# Altium schematic sheet PLC_DIY.SchDoc: PLC_DIY
size A3; DocumentNumber: 1; SheetNumber: 1; SheetTotal: 10
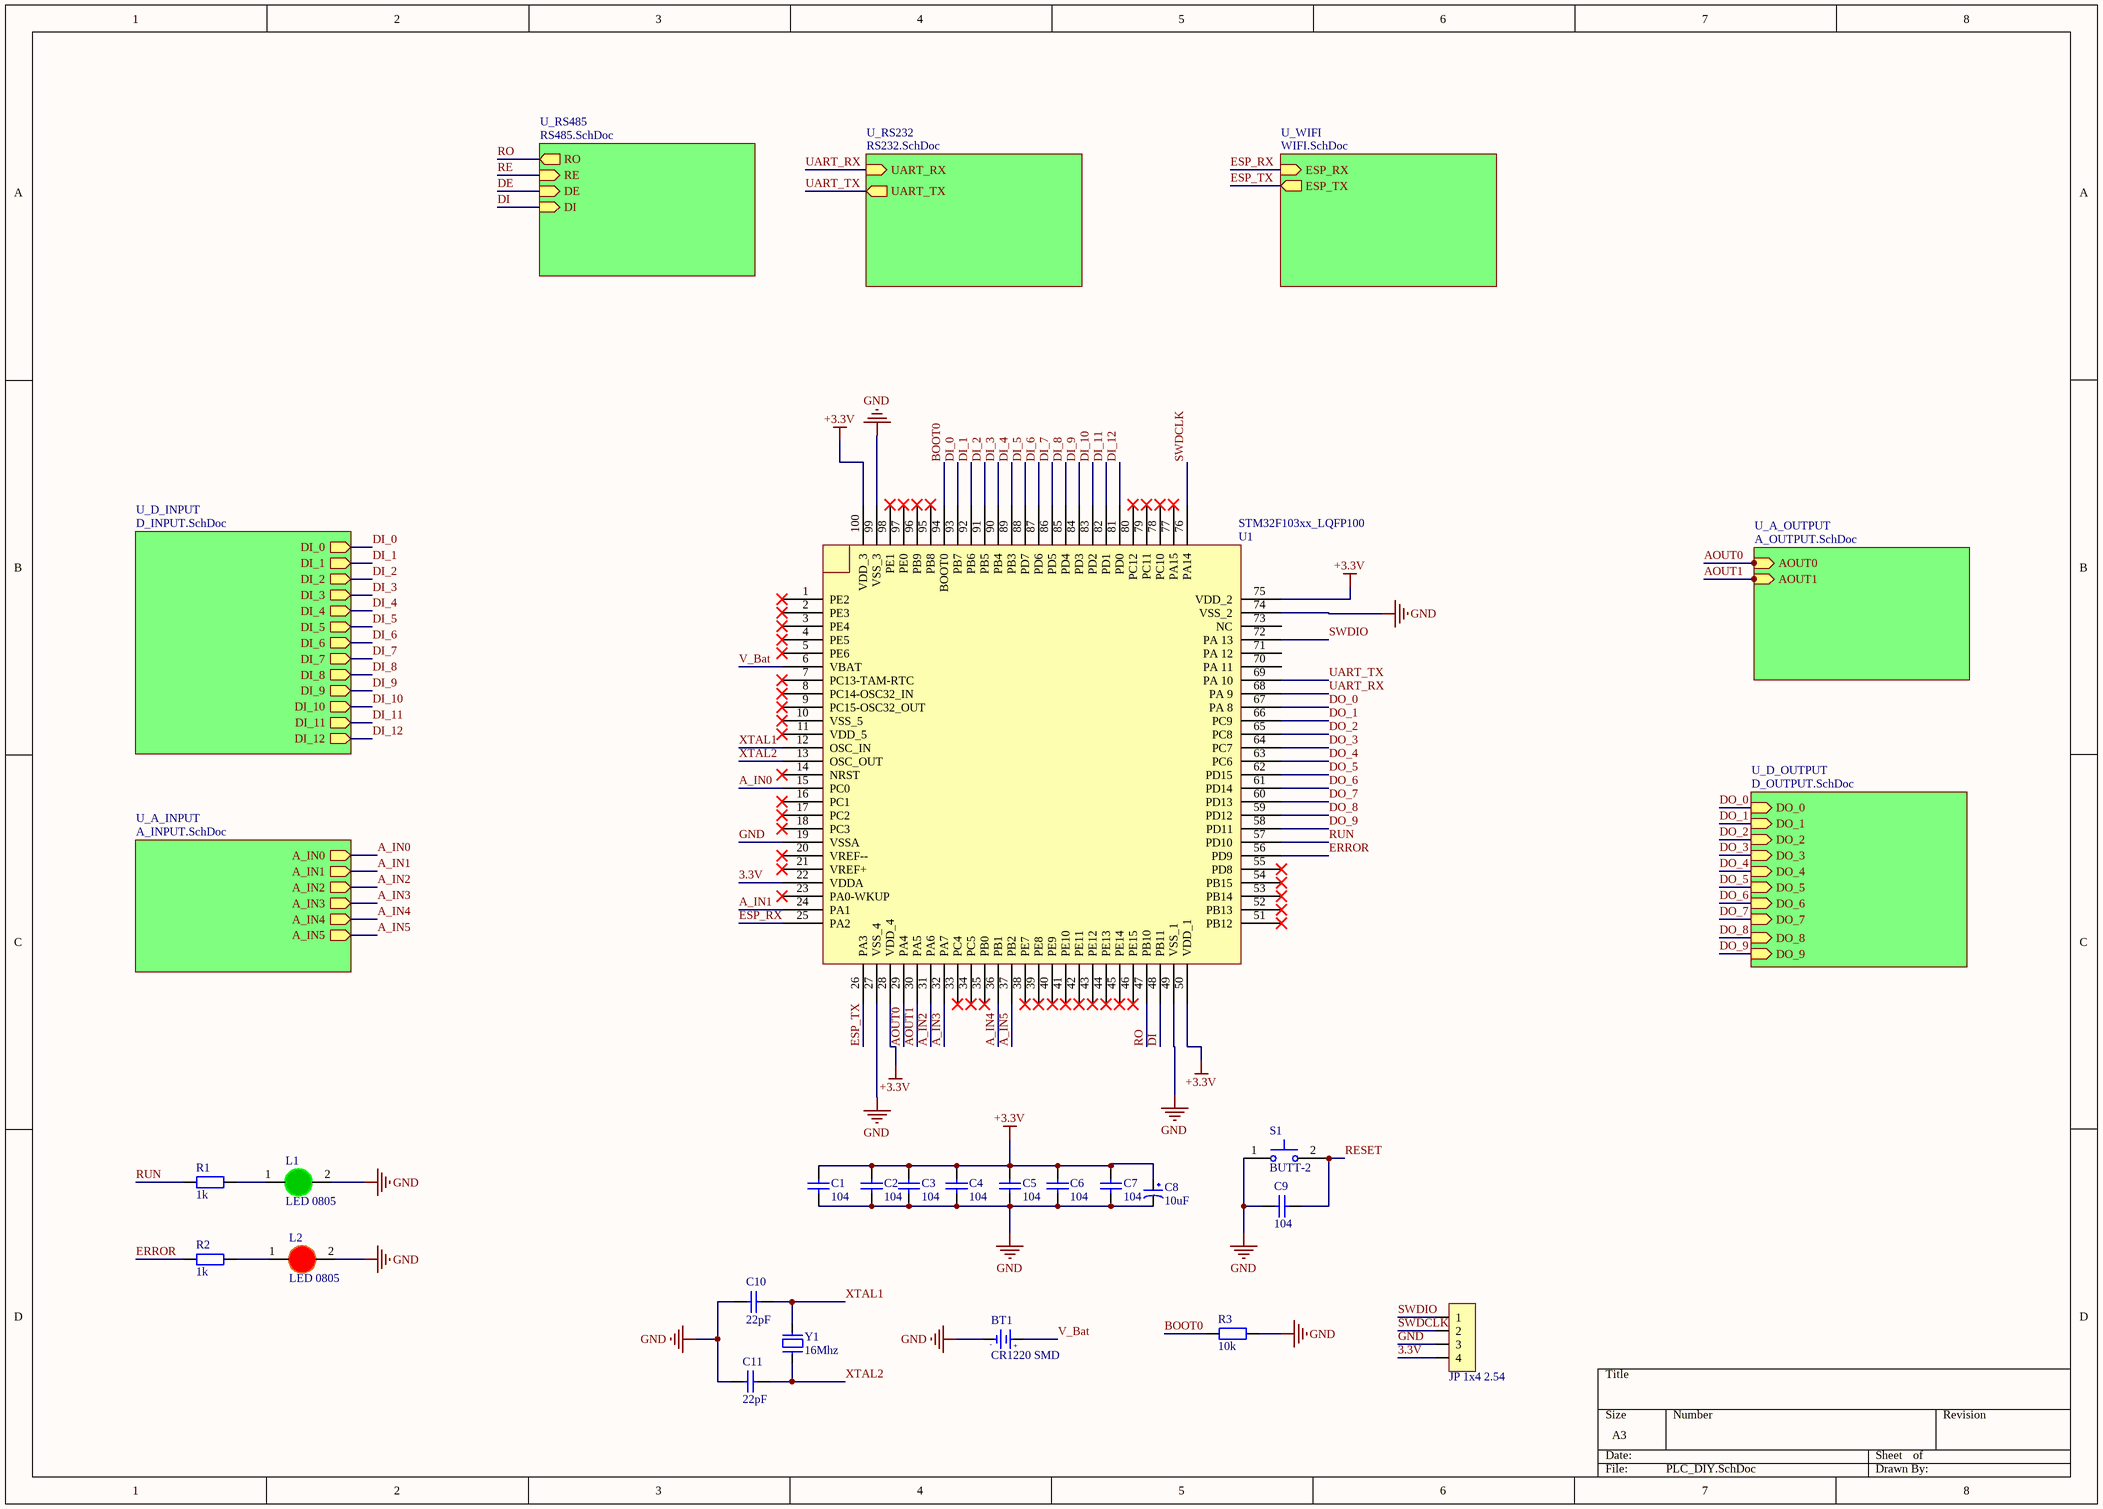
[diagram p0: PLC_DIY.SchDoc]

## Parts
BT1  CR1220 SMD  [DE PIN CR1220]
C1  104  [tu 0805]
C2  104  [tu 0805]
C3  104  [tu 0805]
C4  104  [tu 0805]
C5  104  [tu 0805]
C6  104  [tu 0805]
C7  104  [tu 0805]
C8  10uF  [tu tantalum smd3528]
C9  104  [tu 0805]
C10  22pF  [tu 0805]
C11  22pF  [tu 0805]
JP1  JP 1x4 2.54  [JP 1x4 DC]
L1  LED 0805  [LED-0805-Green]
L2  LED 0805  [LED-0805-Red]
R1  1k  [tro smd 0805]
R2  1k  [tro smd 0805]
R3  10k  [tro smd 0805]
S1  BUTT-2  [SW_BUTT-2]
U1  STM32F103xx_LQFP100  [STM32_LQFP100]
Y1  16Mhz  [Thach Anh 2 chan SMD]

## Sub-sheets
U_A_INPUT = A_INPUT.SchDoc: A_IN0 (out), A_IN1 (out), A_IN2 (out), A_IN3 (out), A_IN4 (out), A_IN5 (out)
U_A_OUTPUT = A_OUTPUT.SchDoc: AOUT0 (in), AOUT1 (in)
U_D_INPUT = D_INPUT.SchDoc: DI_0 (out), DI_1 (out), DI_2 (out), DI_3 (out), DI_4 (out), DI_5 (out), DI_6 (out), DI_7 (out), DI_8 (out), DI_9 (out), DI_10 (out), DI_11 (out), DI_12 (out)
U_D_OUTPUT = D_OUTPUT.SchDoc: DO_0 (in), DO_1 (in), DO_2 (in), DO_3 (in), DO_4 (in), DO_9 (in), DO_5 (in), DO_6 (in), DO_7 (in), DO_8 (in)
U_RS232 = RS232.SchDoc: UART_TX (out), UART_RX (in)
U_RS485 = RS485.SchDoc: RO (out), RE (in), DE (in), DI (in)
U_WIFI = WIFI.SchDoc: ESP_TX (out), ESP_RX (in)

## Nets
+3.3V: C1.1 C2.1 C3.1 C4.1 C5.1 C6.1 C7.1 C8.1 U1.28(VDD_4) U1.50(VDD_1) U1.75(VDD_2) U1.100(VDD_3)
GND: BT1.2(GND) C1.2 C2.2 C3.2 C4.2 C5.2 C6.2 C7.2 C8.2 C9.1 C10.2 C11.2 JP1.3 L1.2(K) L2.2(K) R3.2 S1.1 U1.19(VSSA) U1.27(VSS_4) U1.49(VSS_1) U1.74(VSS_2) U1.99(VSS_3)
3.3V: JP1.4 U1.22(VDDA)
A_IN0: U1.15(PC0) ; sheet U_A_INPUT/A_IN0
A_IN1: U1.24(PA1) ; sheet U_A_INPUT/A_IN1
A_IN2: U1.31(PA6) ; sheet U_A_INPUT/A_IN2
A_IN3: U1.32(PA7) ; sheet U_A_INPUT/A_IN3
A_IN4: U1.36(PB1) ; sheet U_A_INPUT/A_IN4
A_IN5: U1.37(PB2) ; sheet U_A_INPUT/A_IN5
AOUT0: U1.29(PA4) ; sheet U_A_OUTPUT/AOUT0
AOUT1: U1.30(PA5) ; sheet U_A_OUTPUT/AOUT1
BOOT0: R3.1 U1.94(BOOT0)
DE: sheet U_RS485/DE
DI: U1.48(PB11) ; sheet U_RS485/DI
DI_0: U1.93(PB7) ; sheet U_D_INPUT/DI_0
DI_1: U1.92(PB6) ; sheet U_D_INPUT/DI_1
DI_2: U1.91(PB5) ; sheet U_D_INPUT/DI_2
DI_3: U1.90(PB4) ; sheet U_D_INPUT/DI_3
DI_4: U1.89(PB3) ; sheet U_D_INPUT/DI_4
DI_5: U1.88(PD7) ; sheet U_D_INPUT/DI_5
DI_6: U1.87(PD6) ; sheet U_D_INPUT/DI_6
DI_7: U1.86(PD5) ; sheet U_D_INPUT/DI_7
DI_8: U1.85(PD4) ; sheet U_D_INPUT/DI_8
DI_9: U1.84(PD3) ; sheet U_D_INPUT/DI_9
DI_10: U1.83(PD2) ; sheet U_D_INPUT/DI_10
DI_11: U1.82(PD1) ; sheet U_D_INPUT/DI_11
DI_12: U1.81(PD0) ; sheet U_D_INPUT/DI_12
DO_0: U1.67(PA_8) ; sheet U_D_OUTPUT/DO_0
DO_1: U1.66(PC9) ; sheet U_D_OUTPUT/DO_1
DO_2: U1.65(PC8) ; sheet U_D_OUTPUT/DO_2
DO_3: U1.64(PC7) ; sheet U_D_OUTPUT/DO_3
DO_4: U1.63(PC6) ; sheet U_D_OUTPUT/DO_4
DO_5: U1.62(PD15) ; sheet U_D_OUTPUT/DO_5
DO_6: U1.61(PD14) ; sheet U_D_OUTPUT/DO_6
DO_7: U1.60(PD13) ; sheet U_D_OUTPUT/DO_7
DO_8: U1.59(PD12) ; sheet U_D_OUTPUT/DO_8
DO_9: U1.58(PD11) ; sheet U_D_OUTPUT/DO_9
ERROR: R2.1 U1.56(PD9)
ESP_RX: U1.25(PA2) ; sheet U_WIFI/ESP_RX
ESP_TX: U1.26(PA3) ; sheet U_WIFI/ESP_TX
RE: sheet U_RS485/RE
RESET: C9.2 S1.2
RO: U1.47(PB10) ; sheet U_RS485/RO
RUN: R1.1 U1.57(PD10)
SWDCLK: JP1.2 U1.76(PA14)
SWDIO: JP1.1 U1.72(PA_13)
UART_RX: U1.68(PA_9) ; sheet U_RS232/UART_RX
UART_TX: U1.69(PA_10) ; sheet U_RS232/UART_TX
V_Bat: BT1.1(+3V) U1.6(VBAT)
XTAL1: C10.1 U1.12(OSC_IN) Y1.2
XTAL2: C11.1 U1.13(OSC_OUT) Y1.1
NetL1_1: L1.1(A) R1.2
NetL2_1: L2.1(A) R2.2

Not connected (* = marked no-connect by the designer): U1 1(PE2)* 2(PE3)* 3(PE4)* 4(PE5)* 5(PE6)* 7(PC13-TAM-RTC)* 8(PC14-OSC32_IN)* 9(PC15-OSC32_OUT)* 10(VSS_5)* 11(VDD_5)* 14(NRST)* 16(PC1)* 17(PC2)* 18(PC3)* 20(VREF--)* 21(VREF+)* 23(PA0-WKUP)* 33(PC4)* 34(PC5)* 35(PB0)* 38(PE7)* 39(PE8)* 40(PE9)* 41(PE10)* 42(PE11)* 43(PE12)* 44(PE13)* 45(PE14)* 46(PE15)* 51(PB12)* 52(PB13)* 53(PB14)* 54(PB15)* 55(PD8)* 70(PA_11) 71(PA_12) 73(NC) 77(PA15)* 78(PC10)* 79(PC11)* 80(PC12)* 95(PB8)* 96(PB9)* 97(PE0)* 98(PE1)*

## Notes on the sheet
- (in symbol De pin CR1220 SMD) -; +

## Library data of the parts
BT1 = De pin CR1220 SMD: Ten: Đế PIN CR1220 SMD; Ma_Hang: MH000833
C1-C7 C9 = Tu 0805 104 50V 10%: Dán; Don_Vi: Con; So_Chan: 2; Ten_Linh_Kien: Tụ 0805 104-100nF 10% 50V; Ma_Hang: MH004551; Chung_Loai: Dán; Kieu_Chan: *
C8 = Tu tantalum 10uF 16V SMD3528: Dán; Don_Vi: Con; So_Chan: 2; Ten_Linh_Kien: Tụ tantalum 106C-10uF 16V SMD3528; Ma_Hang: MH007474; Chung_Loai: Dán; Kieu_Chan: *
C10 C11 = Tu 0805 22pF 50V 10%: Dán; Don_Vi: Con; So_Chan: 2; Ten_Linh_Kien: Tụ 0805 22P 10% 50V; Ma_Hang: MH004560; Chung_Loai: Dán; Kieu_Chan: *
JP1 = JP 1x4 2.54 Duc Cong: Cắm; Ten_Linh_Kien: Jump Đơn Đực 2.54MM 1x40P Cong Đứng; Don_Vi: Con; Ma_Hang: MH000904; Ghi_Chu: *; Kieu_Chan: *; Chung_Loai: Cắm
L1 = LED 0805 Xanh La: Dán; Don_Vi: Con; Ma_Hang: MH002326; Ten_Linh_Kien: LED 0805 Màu Xanh Lá (Green); Ghi_Chu: *; Kieu_Chan: *; Chung_Loai: Dán
L2 = LED 0805 Do: Dán; Don_Vi: Con; Ma_Hang: MH000897; Ten_Linh_Kien: LED 0805 Màu Đỏ (Red); Ghi_Chu: *; Kieu_Chan: *; Chung_Loai: Dán
R1 R2 = Tro 0805 1% 1k: Dán; Don_Vi: Con; So_Chan: 2; Ten_Linh_Kien: Trở 0805 1% 1k; Ma_Hang: MH005468; Chung_Loai: Dán; Kieu_Chan: *
R3 = Tro 0805 1% 10k: Dán; Don_Vi: Con; So_Chan: 2; Ten_Linh_Kien: Trở 0805 1% 10k; Ma_Hang: MH005473; Chung_Loai: Dán; Kieu_Chan: *
S1 = BUTT-2: Tactile Switches MINI PUSH BUTTON SWITCH 2-PIN QTY. 4; MF: Gravitech; Purchase-URL: https://pricing.snapeda.com/search/part/BUTT-2/?ref=eda; Package: None; Value: *; Check_prices: https://www.snapeda.com/parts/BUTT-2/Gravitech/view-part/?ref=eda; SnapEDA_Link: https://www.snapeda.com/parts/BUTT-2/Gravitech/view-part/?ref=snap; Availability: In Stock; Price: None; MP: BUTT-2
Y1 = Thach Anh 2 chan SMD: Crystal For all Crystal 2pin.; Value: 4Mhz